# EAGLE schematic arduboy-progger (EAGLE 7.7.0)
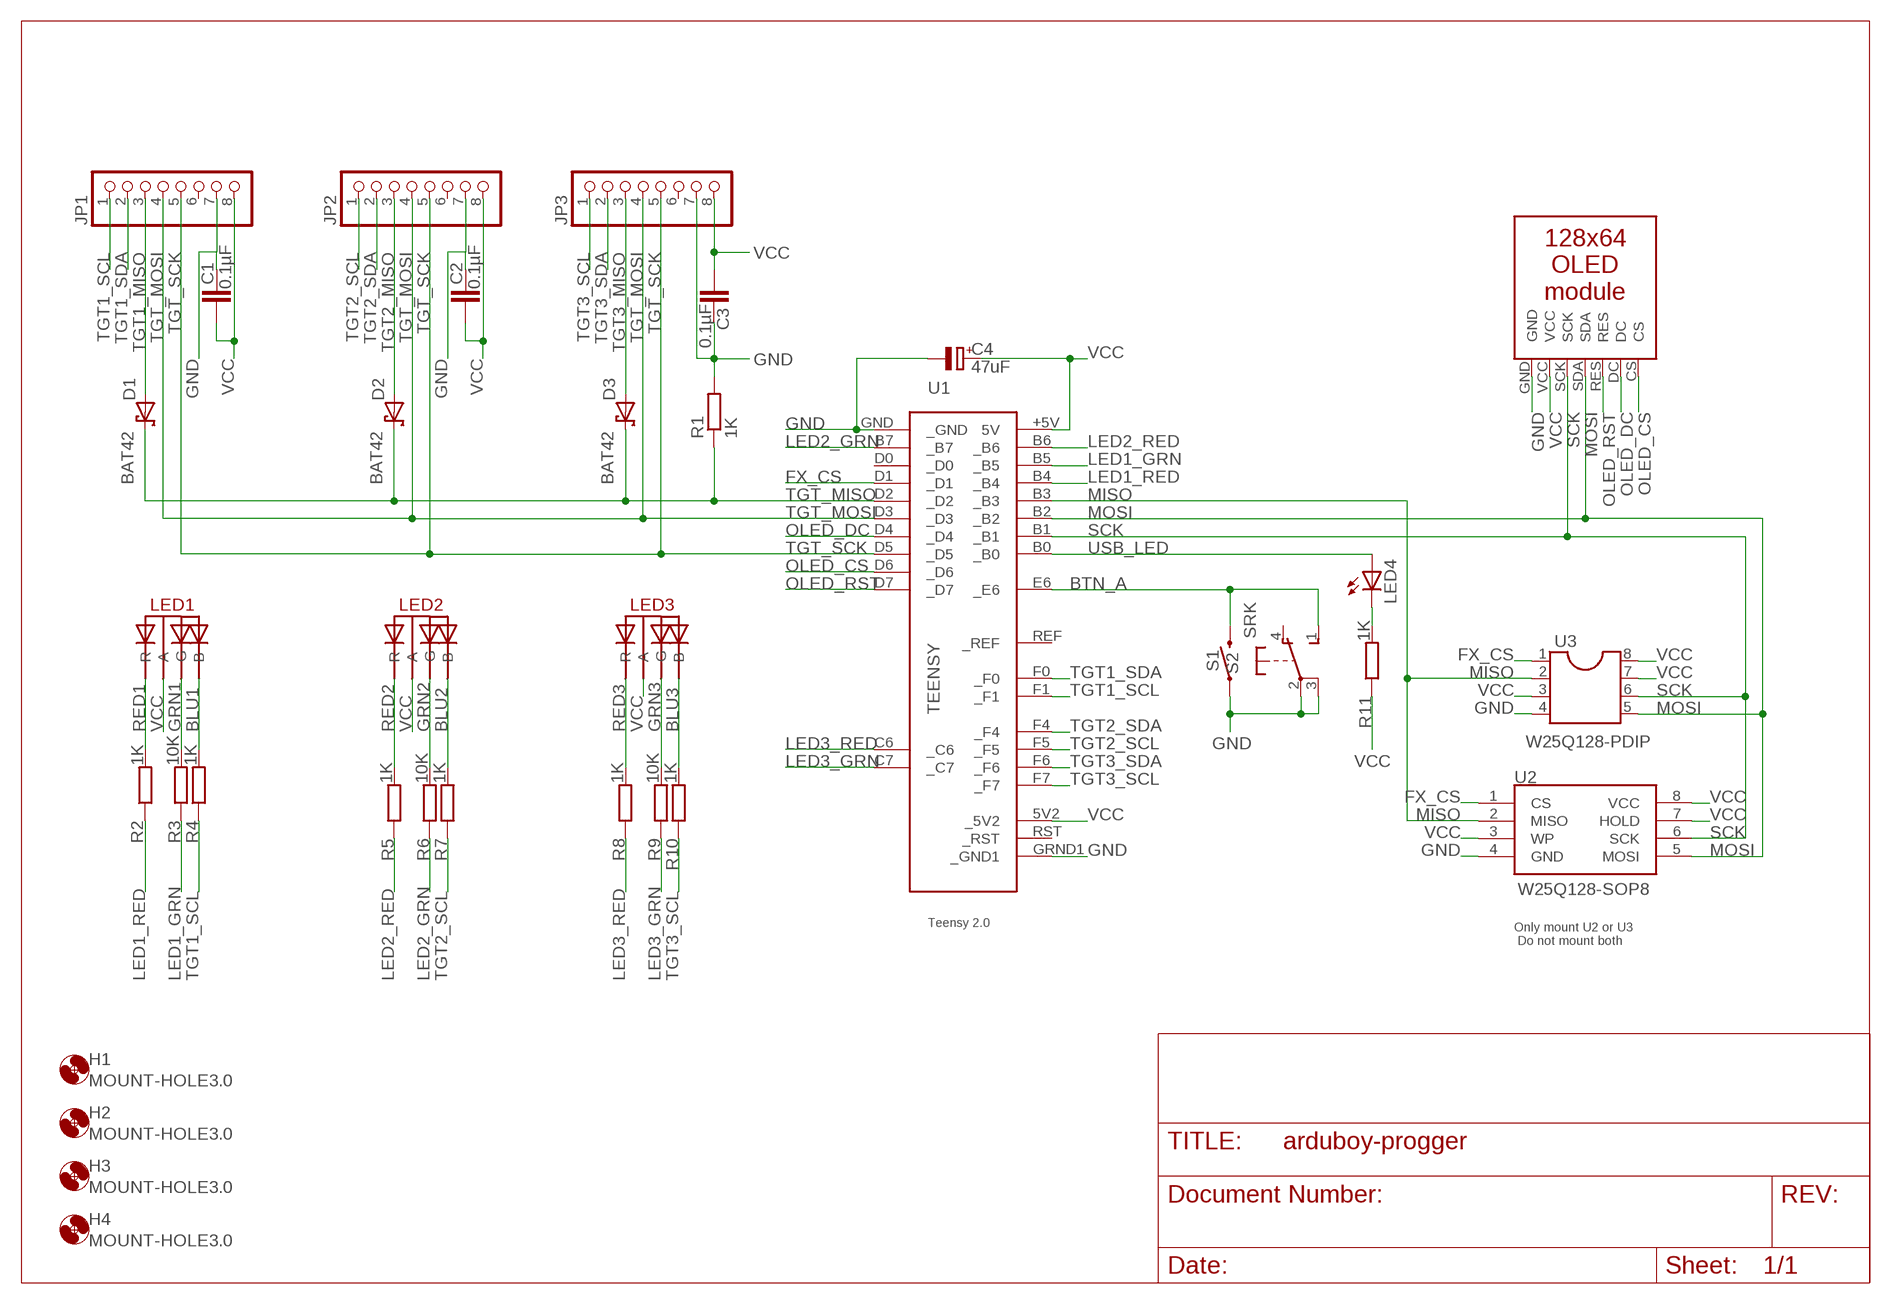
[diagram p0: schematic, sheet 1]

## Parts
C1  0.1µF  C-EU025-025X050  [C025-025X050]
C2  0.1µF  C-EU025-025X050  [C025-025X050]
C3  0.1µF  C-EU025-025X050  [C025-025X050]
C4  47uF  CPOL-EUE2.5-6  [E2,5-6]
D1  BAT42  [DO35-10]
D2  BAT42  [DO35-10]
D3  BAT42  [DO35-10]
H1  MOUNT-HOLE3.0  [3,0]
H2  MOUNT-HOLE3.0  [3,0]
H3  MOUNT-HOLE3.0  [3,0]
H4  MOUNT-HOLE3.0  [3,0]
JP1  PINHD-1X8  [1X08]
JP2  PINHD-1X8  [1X08]
JP3  PINHD-1X8  [1X08]
LED1  5MMRGBLED-CA  [LED5MMRGB]
LED2  5MMRGBLED-CA  [LED5MMRGB]
LED3  5MMRGBLED-CA  [LED5MMRGB]
LED4  LED5MM  [LED5MM]
OLED1  OLED  [OLED]
R1  1K  R-EU_0207/10  [0207/10]
R2  1K  R-EU_0207/10  [0207/10]
R3  10K  R-EU_0207/10  [0207/10]
R4  1K  R-EU_0207/10  [0207/10]
R5  1K  R-EU_0207/10  [0207/10]
R6  10K  R-EU_0207/10  [0207/10]
R7  1K  R-EU_0207/10  [0207/10]
R8  1K  R-EU_0207/10  [0207/10]
R9  10K  R-EU_0207/10  [0207/10]
R10  1K  R-EU_0207/10  [0207/10]
R11  1K  R-EU_0207/10  [0207/10]
S1  MOMENTARY-SWITCH-SPST-PTH-6.0MM  [TACTILE_SWITCH_PTH_6.0MM]
S2  SRK  [SRK]
U1  TEENSY  [TEENSY]
U2  W25Q128-SOP8  SPI_FLASH-X25XXSMD1  [SO08-EIAJ]
U3  W25Q128-PDIP  DIL8S  [SOCKET-08]

## Nets
BLU1: LED1.B$1(B) R4.2
BLU2: LED2.B$1(B) R7.2
BLU3: LED3.B$1(B) R10.2
BTN_A: S1.3 S2.1(S) U1.E6(_E6)
FX_CS: U1.D1(_D1) U2.1(CS) U3.1
GND: C1.1 C2.1 C3.1 C4.- JP1.7 JP2.7 JP3.7 OLED1.GND R1.2 S1.1 S2.2(P) S2.3(P) U1.GND(_GND) U1.GRND1(_GND1) U2.4(GND) U3.4
GRN1: LED1.G$1(G) R3.2
GRN2: LED2.G$1(G) R6.2
GRN3: LED3.G$1(G) R9.2
LED1_GRN: R3.1 U1.B5(_B5)
LED1_RED: R2.1 U1.B4(_B4)
LED2_GRN: R6.1 U1.B7(_B7)
LED2_RED: R5.1 U1.B6(_B6)
LED3_GRN: R9.1 U1.C7(_C7)
LED3_RED: R8.1 U1.C6(_C6)
MISO: U1.B3(_B3) U2.2(MISO) U3.2
MOSI: OLED1.SDA U1.B2(_B2) U2.5(MOSI) U3.5
N$3: LED4.K(C) R11.2
OLED_CS: OLED1.CS U1.D6(_D6)
OLED_DC: OLED1.DC U1.D4(_D4)
OLED_RST: OLED1.RES U1.D7(_D7)
RED1: LED1.R$1(R) R2.2
RED2: LED2.R$1(R) R5.2
RED3: LED3.R$1(R) R8.2
SCK: OLED1.SCK U1.B1(_B1) U2.6(SCK) U3.6
TGT1_MISO: D1.A JP1.3
TGT1_SCL: JP1.1 R4.1 U1.F1(_F1)
TGT1_SDA: JP1.2 U1.F0(_F0)
TGT2_MISO: D2.A JP2.3
TGT2_SCL: JP2.1 R7.1 U1.F5(_F5)
TGT2_SDA: JP2.2 U1.F4(_F4)
TGT3_MISO: D3.A JP3.3
TGT3_SCL: JP3.1 R10.1 U1.F7(_F7)
TGT3_SDA: JP3.2 U1.F6(_F6)
TGT_MISO: D1.C D2.C D3.C R1.1 U1.D2(_D2)
TGT_MOSI: JP1.4 JP2.4 JP3.4 U1.D3(_D3)
TGT_SCK: JP1.5 JP2.5 JP3.5 U1.D5(_D5)
USB_LED: LED4.A U1.B0(_B0)
VCC: C1.2 C2.2 C3.2 C4.+ JP1.8 JP2.8 JP3.8 LED1.C$1(A) LED2.C$1(A) LED3.C$1(A) OLED1.VCC R11.1 U1.5V2(_5V2) U1.+5V(5V) U2.3(WP) U2.7(HOLD) U2.8(VCC) U3.3 U3.7 U3.8
Unconnected: JP1.6 JP2.6 JP3.6 S2.4(O) U1.D0(_D0) U1.REF(_REF) U1.RST(_RST)

## Notes on the sheet
- Only mount U2 or U3
   Do not mount both

## Library data of the parts
C1-C3 = rcl:C-EU: CAPACITOR, European symbol
C4 = rcl:CPOL-EU: POLARIZED CAPACITOR, European symbol
D1-D3 = diode:BAT42: DIODE barrier diode
H1-H4 = holes:MOUNT-HOLE: MOUNTING HOLE with drill center marker
JP1-JP3 = pinhead:PINHD-1X8: PIN HEADER
LED1-LED3 = led_rgb:5MMRGBLED-CA
LED4 = led:LED: LED OSRAM: - CHIPLED LG R971, LG N971, LY N971, LG Q971, LY Q971, LO R971, LY R971 LH N974, LH R974 LS Q976, LO Q976, LY Q976 LO Q996 - Hyper CHIPLED LW Q18S LB Q993, LB Q99A, LB R99A - SideLED LS A670, LO A670, LY A670, LG A670, LP A670 LB A673, LV A673, LT A673, LW A673 LH A674 LY A675 LS A676, LA A676, LO A676, LY A676, LW A676 LS A679, LY A679, LG A679 - Hyper Micro SIDELED® LS Y876, LA Y876, LO Y876, LY Y876 LT Y87S - SmartLED LW L88C, LW L88S LB L89C, LB L89S, LG L890 LS L89K, LO L89K, LY L89K LS L896, LA L896, LO L896, LY L896 - TOPLED LS T670, LO T670, LY T670, LG T670, LP T670 LSG T670, LSP T670, LSY T670, LOP T670, LYG T670 LG T671, LOG T671, LSG T671 LB T673, LV T673, LT T673, LW T673 LH T674 LS T676, LA T676, LO T676, LY T676, LB T676, LH T676, LSB T676, LW T676 LB T67C, LV T67C, LT T67C, LS T67K, LO T67K, LY T67K, LW E67C LS E67B, LA E67B, LO E67B, LY E67B, LB E67C, LV E67C, LT E67C LW T67C LS T679, LY T679, LG T679 LS T770, LO T770, LY T770, LG T770, LP T770 LB T773, LV T773, LT T773, LW T773 LH T774 LS E675, LA E675, LY E675, LS T675 LS T776, LA T776, LO T776, LY T776, LB T776 LHGB T686 LT T68C, LB T68C - Hyper Mini TOPLED® LB M676 - Mini TOPLED Santana® LG M470 LS M47K, LO M47K, LY M47K Source: http://www.osram.convergy.de LUXEON: - LUMILED® LXK2-PW12-R00, LXK2-PW12-S00, LXK2-PW14-U00, LXK2-PW14-V00 LXK2-PM12-R00, LXK2-PM12-S00, LXK2-PM14-U00 LXK2-PE12-Q00, LXK2-PE12-R00, LXK2-PE12-S00, LXK2-PE14-T00, LXK2-PE14-U00 LXK2-PB12-K00, LXK2-PB12-L00, LXK2-PB12-M00, LXK2-PB14-N00, LXK2-PB14-P00, LXK2-PB14-Q00 LXK2-PR12-L00, LXK2-PR12-M00, LXK2-PR14-Q00, LXK2-PR14-R00 LXK2-PD12-Q00, LXK2-PD12-R00, LXK2-PD12-S00 LXK2-PH12-R00, LXK2-PH12-S00 LXK2-PL12-P00, LXK2-PL12-Q00, LXK2-PL12-R00 Source: www.luxeon.com KINGBRIGHT: KA-3528ASYC Source: www.kingbright.com
OLED1 = tinygear-parts:OLED
R1-R11 = rcl:R-EU_: RESISTOR, European symbol
S1 = avr-hvsp-programmer:MOMENTARY-SWITCH-SPST: Momentary Switch (Pushbutton) - SPST Normally-open (NO) SPST momentary switches (buttons, pushbuttons). Variants PTH-12MM - 12mm square, through-hole Momentary Pushbutton Switch - 12mm Square <https://www.sparkfun.com/products/9190> (COM-09190) PTH-6.0MM, PTH-6.0MM-KIT - 6.0mm square, through-hole Mini Pushbutton Switch <https://www.sparkfun.com/products/97> (COM-00097) KIT package intended for soldering kit's - only one side of pads' copper is exposed. PTH-RIGHT-ANGLE-KIT - Right-angle, through-hole Right Angle Tactile Button <https://www.sparkfun.com/products/10791> - Used on SparkFun BigTime Watch Kit <https://www.sparkfun.com/products/11734> SMD-12MM - 12mm square, surface-mount Tactile Button - SMD (12mm) <https://www.sparkfun.com/products/12993> (COM-12993) Used on SparkFun PicoBoard <https://www.sparkfun.com/products/11888> SMD-4.5MM - 4.5mm Square Trackball Switch Used on SparkFun Blackberry Trackballer Breakout <https://www.sparkfun.com/products/13169> SMD-4.6MMX2.8MM - 4.60mm x 2.80mm, surface mount Used on SparkFun SAMD21 Mini Breakout <https://www.sparkfun.com/products/13664> SMD-5.2MM, SMD-5.2-REDUNDANT - 5.2mm square, surface-mount Mini Pushbutton Switch - SMD <https://www.sparkfun.com/products/8720> (COM-08720) Used on Arduino Pro Mini <https://www.sparkfun.com/products/11114> REDUNDANT package connects both switch circuits together SMD-6.0X3.5MM - 6.0 x 3.5mm, surface mount Momentary Reset Switch SMD <https://www.sparkfun.com/products/8229> (COM-08229) SMD-6.2MM-TALL - 6.2mm square, surface mount Tactile Button - SMD (6mm) <https://www.sparkfun.com/products/12992> Used on SparkFun Digital Sandbox <https://www.sparkfun.com/products/12651> SMD-RIGHT-ANGLE - Right-angle, surface mount Used on SparkFun Block for Intel® Edison - Arduino <https://www.sparkfun.com/products/13036>; PROD_ID: SWCH-08441; SF_SKU: COM-00097
S2 = switch-misc:SRK: SWITCH
U1 = teensy:TEENSY: Teensy 2.0 Original Design by Clint Fisher Modified Design by Tamir Emran Licensed Under Creative Commons Attribution-ShareAlike 3.0 Unported (CC BY-SA 3.0)
U2 = flashcart:SPI_FLASH-X25XX: 32M Serial Flash Memory 8pin SPI Flash series x25xx. Works with devices like W25X32 and BR25L32 Datasheet <http://www.macronix.com/Lists/Datasheet/Attachments/5031/MX25L3206E,%203V,%2032Mb,%20v1.5.pdf> SparkFun Products SparkFun Venus GPS Logger <https://www.sparkfun.com/products/10920> (GPS-10920); PROD_ID: IC-09109; VALUE: 25F32006WSOI
U3 = ic-package:DIL8: Dual In Line / Socket